# Altium project ESP32.PrjPcb
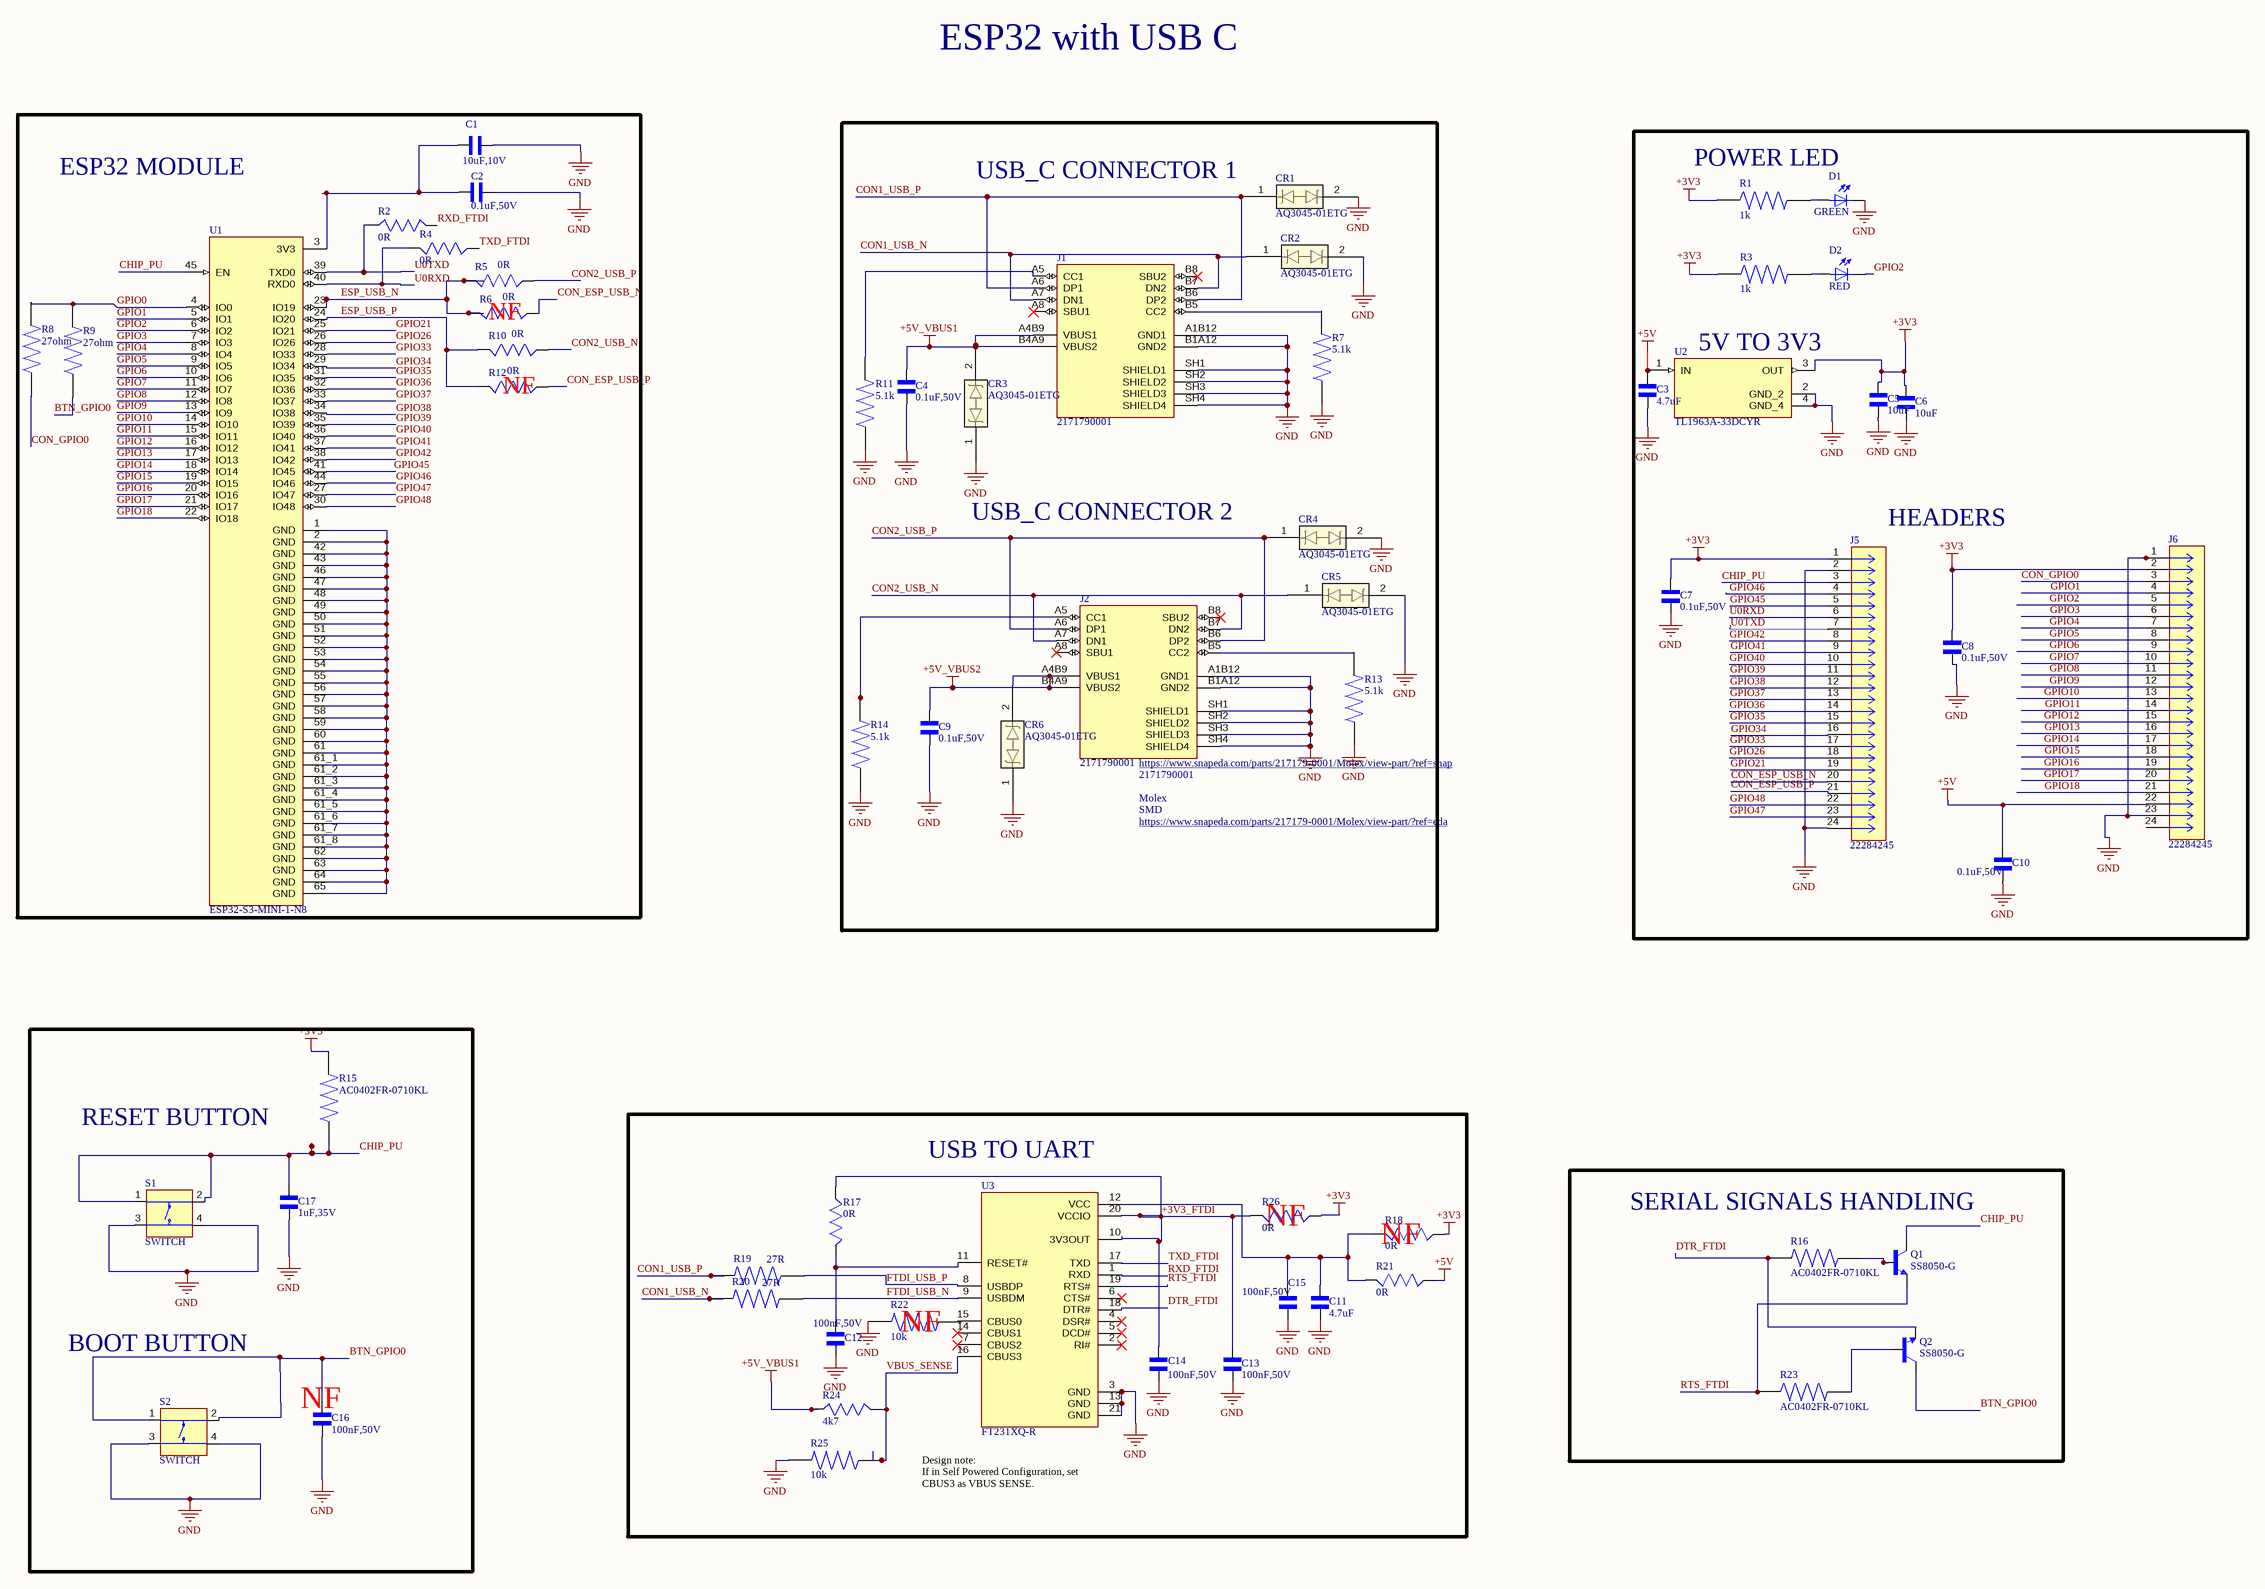
[diagram p0: ESP32.SchDoc]
1 sheet, 62 parts. Net scope: global (net labels, ports and power ports of the same name join across sheets).
Board file: ESP32.PcbDoc

## Sheet ESP32.SchDoc
size 594 x 420 mm; SheetNumber: 1; SheetTotal: 1

### Parts
C1  10uF,10V  [CAPC1005X90N]
C2  0.1uF,50V  [CAPC1005X55N]
C3  4.7uF  [CAPC1005X55N]
C4  0.1uF,50V  [CAPC1005X55N]
C5  10uF  [CAPC1005X90N]
C6  10uF  [CAPC1005X90N]
C7  0.1uF,50V  [CAPC1005X55N]
C8  0.1uF,50V  [CAPC1005X55N]
C9  0.1uF,50V  [CAPC1005X55N]
C10  0.1uF,50V  [CAPC1005X55N]
C11  4.7uF  [CAPC1005X55N]
C12  100nF,50V  [CAPC1005X55N]
C13  100nF,50V  [CAPC1005X55N]
C14  100nF,50V  [CAPC1005X55N]
C15  100nF,50V  [CAPC1005X55N]
C16  100nF,50V  [CAPC1005X55N]
C17  1uF,35V  [CAPC1005X65N]
CR1  AQ3045-01ETG  [RTVS_SOD882_LTF]
CR2  AQ3045-01ETG  [RTVS_SOD882_LTF]
CR3  AQ3045-01ETG  [RTVS_SOD882_LTF]
CR4  AQ3045-01ETG  [RTVS_SOD882_LTF]
CR5  AQ3045-01ETG  [RTVS_SOD882_LTF]
CR6  AQ3045-01ETG  [RTVS_SOD882_LTF]
D1  GREEN  [LEDC1005X35N]
D2  RED  [LEDC1005X35N]
J1  2171790001  [MOLEX_2171790001]
J2  2171790001  Manufacturer: Molex  Package: SMD  [MOLEX_2171790001]
J5  22284245  [CONN_SD-42375-001_M295_24_MOL]
J6  22284245  [CONN_SD-42375-001_M295_24_MOL]
Q1  SS8050-G  [TRANS_SS8050-G]
Q2  SS8050-G  [TRANS_SS8050-G]
R1  1k  [RESC1005X40N]
R2  0R  [RESC1005X40]
R3  1k  [RESC1005X40N]
R4  0R  [RESC1005X40]
R5  0R  [RESC1005X40]
R6  0R  [RESC1005X40]
R7  5.1k  [RESC1005X40N]
R8  27ohm  [RESC1005X40N]
R9  27ohm  [RESC1005X40N]
R10  0R  [RESC1005X40]
R11  5.1k  [RESC1005X40N]
R12  0R  [RESC1005X40]
R13  5.1k  [RESC1005X40N]
R14  5.1k  [RESC1005X40N]
R15  AC0402FR-0710KL  [RESC1005X37N]
R16  AC0402FR-0710KL  [RESC1005X37N]
R17  0R  [RESC1005X40]
R18  0R  [RESC1005X40]
R19  27R  [RESC1005X40N]
R20  27R  [RESC1005X40N]
R21  0R  [RESC1005X40]
R22  10k  [RESC1005X37N]
R23  AC0402FR-0710KL  [RESC1005X37N]
R24  4k7  [RESC1005X40]
R25  10k  [RESC1005X37N]
R26  0R  [RESC1005X40]
S1  SWITCH  [SWITCH_43SMTR92LFS]
S2  SWITCH  [SWITCH_43SMTR92LFS]
U1  ESP32-S3-MINI-1-N8  [XCVR_ESP32-S3-MINI-1-N8]
U2  TL1963A-33DCYR  [VREG_TL1963A-33DCYR]
U3  FT231XQ-R  [QFN50P400X400X80-21N]

### Blocks framed on the sheet
NF: C16 C17 R15 S1 S2
SERIAL SIGNALS HANDLING: Q1 Q2 R16 R23

### Nets
+3V3: C5.2 C6.2 C7.2 C8.2 J5.1 J6.2 R1.1 R3.1 R15.2 R18.2 R26.2 U2.3(OUT)
+5V: C3.2 C10.2 J6.22 R21.2 U2.1(IN)
+5V_VBUS1: C4.2 CR3.2 J1.A4B9(VBUS1) J1.B4A9(VBUS2) R24.2
+5V_VBUS2: C9.2 CR6.2 J2.A4B9(VBUS1) J2.B4A9(VBUS2)
GND: C1.2 C2.1 C3.1 C4.1 C5.1 C6.1 C7.1 C8.1 C9.1 C10.1 C11.1 C12.1 C13.1 C14.1 C15.1 C16.1 C17.2 CR1.2 CR2.2 CR3.1 CR4.2 CR5.2 CR6.1 D1.2 J1.A1B12(GND1) J1.B1A12(GND2) J1.SH1(SHIELD1) J1.SH2(SHIELD2) J1.SH3(SHIELD3) J1.SH4(SHIELD4) J2.A1B12(GND1) J2.B1A12(GND2) J2.SH1(SHIELD1) J2.SH2(SHIELD2) J2.SH3(SHIELD3) J2.SH4(SHIELD4) J5.2 J5.24 J6.1 J6.23 R7.1 R11.1 R13.1 R14.1 R22.2 R25.2 S1.3 S1.4 S2.3 S2.4 U2.2(GND_2) U2.4(GND_4) U3.3(GND) U3.13(GND) U3.21(GND)
+3V3_FTDI: C13.2 C14.2 R17.2 R26.1 U3.10(3V3OUT) U3.20(VCCIO)
BTN_GPIO0: C16.2 Q2.3(C) R9.1 S2.1 S2.2
CHIP_PU: C17.1 J5.3 Q1.3(C) R15.1 S1.1 S1.2 U1.45(EN)
CON1_USB_N: CR2.1 J1.A7(DN1) J1.B7(DN2) R20.1
CON1_USB_P: CR1.1 J1.A6(DP1) J1.B6(DP2) R19.1
CON2_USB_N: CR5.1 J2.A7(DN1) J2.B7(DN2) R10.2
CON2_USB_P: CR4.1 J2.A6(DP1) J2.B6(DP2) R5.2
CON_ESP_USB_N: J5.20 R6.2
CON_ESP_USB_P: J5.21 R12.2
CON_GPIO0: J6.3 R8.1
DTR_FTDI: Q2.2(E) R16.1 U3.18(DTR#)
ESP_USB_N: R5.1 R6.1 U1.23(IO19)
ESP_USB_P: R10.1 R12.1 U1.24(IO20)
FTDI_USB_N: R20.2 U3.9(USBDM)
FTDI_USB_P: R19.2 U3.8(USBDP)
GPIO0: R8.2 R9.2 U1.4(IO0)
GPIO1: J6.4 U1.5(IO1)
GPIO2: D2.2 J6.5 U1.6(IO2)
GPIO3: J6.6 U1.7(IO3)
GPIO4: J6.7 U1.8(IO4)
GPIO5: J6.8 U1.9(IO5)
GPIO6: J6.9 U1.10(IO6)
GPIO7: J6.10 U1.11(IO7)
GPIO8: J6.11 U1.12(IO8)
GPIO9: J6.12 U1.13(IO9)
GPIO10: J6.13 U1.14(IO10)
GPIO11: J6.14 U1.15(IO11)
GPIO12: J6.15 U1.16(IO12)
GPIO13: J6.16 U1.17(IO13)
GPIO14: J6.17 U1.18(IO14)
GPIO15: J6.18 U1.19(IO15)
GPIO16: J6.19 U1.20(IO16)
GPIO17: J6.20 U1.21(IO17)
GPIO18: J6.21 U1.22(IO18)
GPIO21: J5.19 U1.25(IO21)
GPIO26: J5.18 U1.26(IO26)
GPIO33: J5.17 U1.28(IO33)
GPIO34: J5.16 U1.29(IO34)
GPIO35: J5.15 U1.31(IO35)
GPIO36: J5.14 U1.32(IO36)
GPIO37: J5.13 U1.33(IO37)
GPIO38: J5.12 U1.34(IO38)
GPIO39: J5.11 U1.35(IO39)
GPIO40: J5.10 U1.36(IO40)
GPIO41: J5.9 U1.37(IO41)
GPIO42: J5.8 U1.38(IO42)
GPIO45: J5.5 U1.41(IO45)
GPIO46: J5.4 U1.44(IO46)
GPIO47: J5.23 U1.27(IO47)
GPIO48: J5.22 U1.30(IO48)
RTS_FTDI: Q1.2(E) R23.1 U3.19(RTS#)
RXD_FTDI: R2.1 U3.1(RXD)
TXD_FTDI: R4.2 U3.17(TXD)
U0RXD: J5.6 R4.1 U1.40(RXD0)
U0TXD: J5.7 R2.2 U1.39(TXD0)
VBUS_SENSE: R24.1 R25.1 U3.16(CBUS3)
NetC1_1: C1.1 C2.2 U1.3(3V3)
NetC11_2: C11.2 C15.2 R18.1 R21.1 U3.12(VCC)
NetC12_2: C12.2 R17.1 U3.11(RESET#)
NetD1_1: D1.1 R1.2
NetD2_1: D2.1 R3.2
NetJ1_A5: J1.A5(CC1) R11.2
NetJ1_B5: J1.B5(CC2) R7.2
NetJ2_A5: J2.A5(CC1) R14.2
NetJ2_B5: J2.B5(CC2) R13.2
NetQ1_1: Q1.1(B) R16.2
NetQ2_1: Q2.1(B) R23.2
NetR22_1: R22.1 U3.15(CBUS0)
NetU1_1: U1.1(GND) U1.2(GND) U1.42(GND) U1.43(GND) U1.46(GND) U1.47(GND) U1.48(GND) U1.49(GND) U1.50(GND) U1.51(GND) U1.52(GND) U1.53(GND) U1.54(GND) U1.55(GND) U1.56(GND) U1.57(GND) U1.58(GND) U1.59(GND) U1.60(GND) U1.61(GND) U1.61_1(GND) U1.61_2(GND) U1.61_3(GND) U1.61_4(GND) U1.61_5(GND) U1.61_6(GND) U1.61_7(GND) U1.61_8(GND) U1.62(GND) U1.63(GND) U1.64(GND) U1.65(GND)

Not connected (* = marked no-connect by the designer): J1 A8(SBU1) B8(SBU2)*; J2 A8(SBU1)* B8(SBU2)*; J6 24; U3 2(RI#)* 4(DSR#)* 5(DCD#)* 6(CTS#)* 7(CBUS2)* 14(CBUS1)*

### Notes on the sheet
- ESP32 with USB C
- ESP32 MODULE
- USB_C CONNECTOR 1
- POWER LED
- (near R6) NF
- (near U2) 5V TO 3V3
- (near R12) NF
- USB_C CONNECTOR 2
- (near J5) HEADERS
- RESET BUTTON
- (near U3) USB TO UART
- (near R26) NF
- (near R18) NF
- BOOT BUTTON
- (near R22) NF
- (near U3) Design note:
  If in Self Powered Configuration, set CBUS3 as VBUS SENSE.
- DWG NO:
- REV:
- THIS DOCUMENT AND THE DATA DISCLOSED HEREIN OR
- HEREWITH IS THE PROPERTY OF ALTIUM LIMITED AND MAY
- BE FREELY DISTRIBUTED IN WHOLE. NO RIGHTS ARE
- RESERVED OR EXPRESS OR IMPLIED WARANTEE GIVEN.
- REVISION
- DESCRIPTION
- DATE
- APPROVED
- ENG:
- APPROVALS
- PROJECT
- DSN:
- CHK:
- REFERENCE DOCUMENTS
- PROJECT REVISION:
- TITLE
- DOCUMENT REVISION:
- DESIGN ITEM:
- BOM:
- FAB DWG:
- PCB DWG:
- ASSY DWG:
- SCALE:
- A2
- SIZE
- CAGE CODE
- FILE NAME
- DWG NO.
- SHEET
- OF
- REV

### Library data of the parts
C1 C5 C6 = CL05A106MP8NUB8: 10 ÂµF Â±20% 10V Ceramic Capacitor X5R 0402 (1005 Metric); MF: Samsung Electro-Mechanics; SnapEDA_Link: https://www.snapeda.com/parts/CL05A106MP8NUB8/Samsung/view-part/?ref=snap; Package: SMD-2 Samsung; Value: *; MP: CL05A106MP8NUB8; Check_prices: https://www.snapeda.com/parts/CL05A106MP8NUB8/Samsung/view-part/?ref=eda
C2 C4 C7-C10 C12-C16 = CL05B104KB5NNNC: 0.1 ÂµF Â±10% 50V Ceramic Capacitor X7R 0402 (1005 Metric); MF: Samsung Electro-Mechanics; SnapEDA_Link: https://www.snapeda.com/parts/CL05B104KB5NNNC/Samsung/view-part/?ref=snap; Package: SMD-2 Samsung; Value: *; MP: CL05B104KB5NNNC; Check_prices: https://www.snapeda.com/parts/CL05B104KB5NNNC/Samsung/view-part/?ref=eda
C3 C11 = CL05A475MO5LUNC: 4.7 ÂµF Â±20% 16V Ceramic Capacitor X5R 0402 (1005 Metric); MF: Samsung Electro-Mechanics; SnapEDA_Link: https://www.snapeda.com/parts/CL05A475MO5LUNC/Samsung/view-part/?ref=snap; Package: SMD-2 Samsung; Value: *; MP: CL05A475MO5LUNC; Check_prices: https://www.snapeda.com/parts/CL05A475MO5LUNC/Samsung/view-part/?ref=eda
C17 = CL05A105KL5NRNC: 1 ÂµF Â±10% 35V Ceramic Capacitor X5R 0402 (1005 Metric); MF: Samsung; SnapEDA_Link: https://www.snapeda.com/parts/CL05A105KL5NRNC/Samsung/view-part/?ref=snap; Package: SMD-2 Samsung; Value: *; MP: CL05A105KL5NRNC; Check_prices: https://www.snapeda.com/parts/CL05A105KL5NRNC/Samsung/view-part/?ref=eda
CR1-CR6 = AQ3045-01ETG: Description; Manufacturer_Name: Littelfuse Inc; Copyright: Copyright (C) 2025 Ultra Librarian. All rights reserved.; Manufacturer_Part_Number: AQ3045-01ETG; RefDes: RefDes; Type: Type
D1 D2 = VLMG1500-GS08: Yellow-Green 571nm LED Indication - Discrete 2V 0402 (1005 Metric); MF: Vishay; SnapEDA_Link: https://www.snapeda.com/parts/VLMG1500-GS08/Vishay+Semiconductor+Opto+Division/view-part/?ref=snap; Package: Connector; Value: *; MP: VLMG1500-GS08; Check_prices: https://www.snapeda.com/parts/VLMG1500-GS08/Vishay+Semiconductor+Opto+Division/view-part/?ref=eda
J1 J2 = 2171790001: USB Type C - Connector, Top-mount SMT, 16pos | Molex Incorporated 217179-0001; SnapEDA_Link: https://www.snapeda.com/parts/217179-0001/Molex/view-part/?ref=snap; JLCPCB Part #: C3197684; Check_prices: https://www.snapeda.com/parts/217179-0001/Molex/view-part/?ref=eda
  J1: Package: SMD; Manufacturer: Molex; Manufacturer Part #: 217179-0001
  J2: Manufacturer Part #: 2171790001
J5 J6 = 22284245: Connector Header Through Hole 24 position 0.100 (2.54mm); MF: Molex; SnapEDA_Link: https://www.snapeda.com/parts/22-28-4245/Molex/view-part/?ref=snap; Package: None; Value: *; MP: 22-28-4245; Check_prices: https://www.snapeda.com/parts/22-28-4245/Molex/view-part/?ref=eda
Q1 Q2 = SS8050-G: Bipolar (BJT) Transistor NPN 25 V 1.5 A 100MHz 300 mW Surface Mount SOT-23-3; MP: SS8050G; MF: Comchip; Digi-Key_Part_Number: 641-1790-2-ND; Check_prices: https://www.snapeda.com/parts/SS8050G/Comchip/view-part/?ref=eda; Package: None; SnapEDA_Link: https://www.snapeda.com/parts/SS8050G/Comchip/view-part/?ref=snap; Value: *
R1 R3 = RC0402FR-071KL: 1 kOhms Â±1% 0.063W, 1/16W Chip Resistor 0402 (1005 Metric) Moisture Resistant Thick Film; MF: Yageo Corporation; MP: RC0402FR071KL; SnapEDA_Link: https://www.snapeda.com/parts/RC0402FR071KL/Yageo/view-part/?ref=snap; Package: 0402-2 YAGEO; Value: *; Check_prices: https://www.snapeda.com/parts/RC0402FR071KL/Yageo/view-part/?ref=eda
R2 R4-R6 R10 R12 R17 R18 R21 R26 = RC0402JR-070RL: 0 Ohms Jumper 0.063W, 1/16W Chip Resistor 0402 (1005 Metric) Moisture Resistant Thick Film; MF: Yageo; Purchase-URL: https://pricing.snapeda.com/search/part/RC0402JR-070RL/?ref=eda; Package: 0402 Yageo; Digi-Key_Part_Number: 311-0.0JRTR-ND; MP: RC0402JR-070RL; Check_prices: https://www.snapeda.com/parts/RC0402JR-070RL/Yageo/view-part/?ref=eda; Value: *; SnapEDA_Link: https://www.snapeda.com/parts/RC0402JR-070RL/Yageo/view-part/?ref=snap
R7-R9 R11 R13 R14 R19 R20 = RC0402FR-0727RL: 27 Ohms Â±1% 0.063W, 1/16W Chip Resistor 0402 (1005 Metric) Moisture Resistant Thick Film; MF: Yageo; SnapEDA_Link: https://www.snapeda.com/parts/RC0402FR-0727RL/Yageo/view-part/?ref=snap; Package: 1005 Panasonic Electronic Components; Value: *; MP: RC0402FR-0727RL; Check_prices: https://www.snapeda.com/parts/RC0402FR-0727RL/Yageo/view-part/?ref=eda
R15 R16 R22 R23 R25 = AC0402FR-0710KL: 10 kOhms Â±1% 0.063W, 1/16W Chip Resistor 0402 (1005 Metric) Automotive AEC-Q200, Moisture Resistant Thick Film; MF: Yageo; MP: AC0402FR-0710KL; Package: 1005 Yageo; Purchase-URL: https://pricing.snapeda.com/search/part/AC0402FR-0710KL/?ref=eda; Check_prices: https://www.snapeda.com/parts/AC0402FR-0710KL/Yageo/view-part/?ref=eda; Value: *; Digi-Key_Part_Number: YAG3436TR-ND; SnapEDA_Link: https://www.snapeda.com/parts/AC0402FR-0710KL/Yageo/view-part/?ref=snap
R24 = RC0402FR-074K7L: 4.7 kOhms Â±1% 0.063W, 1/16W Chip Resistor 0402 (1005 Metric) Moisture Resistant Thick Film; MF: Yageo; SnapEDA_Link: https://www.snapeda.com/parts/RC0402FR-074K7L/Yageo/view-part/?ref=snap; Package: 1005 Panasonic Electronic Components; Value: *; MP: RC0402FR-074K7L; Check_prices: https://www.snapeda.com/parts/RC0402FR-074K7L/Yageo/view-part/?ref=eda
S1 S2 = PTS645SK50SMTR92LFS: Switch;Tactile;SPST-NO;OFF-MOM;Top Actuator;260 Grams;4.3mm;.05A;12VDC;Gull Wing | C&K PTS645SK50SMTR92 LFS; SnapEDA_Link: https://www.snapeda.com/parts/PTS645SK50SMTR92%20LFS/C%2526K/view-part/?ref=snap; Package: None; Value: *; MF: C&K; MP: PTS645SK50SMTR92 LFS; Check_prices: https://www.snapeda.com/parts/PTS645SK50SMTR92%20LFS/C%2526K/view-part/?ref=eda
U1 = ESP32-S3-MINI-1-N8: Manufacturer: Espressif Systems; MFR.Part #: ESP32-S3-MINI-1-N8; JLCPCB Part #: C2913206; Package: SMD; Parameter 1: *
U2 = TL1963A-33DCYR: 1.5-A, 20-V, low-dropout voltage regulator with reverse current & reverse voltage protection; MF: Texas Instruments; SnapEDA_Link: https://www.snapeda.com/parts/TL1963A-33DCYR/Texas+Instruments/view-part/?ref=snap; Package: SOT-223-4 Texas Instruments; Value: *; MP: TL1963A-33DCYR; Check_prices: https://www.snapeda.com/parts/TL1963A-33DCYR/Texas+Instruments/view-part/?ref=eda
U3 = FT231XQ-R: USB2.0 Full Speed IC offers a compact bridge to full handshake UART Interface; Package: None; Price: None; Availability: Unavailable; MP: FT231XQ-R; Value: *

## Assembly variants
Variant of ESP32V2.0: all parts fitted